# Altium project CW308T_K24F.PrjPcb
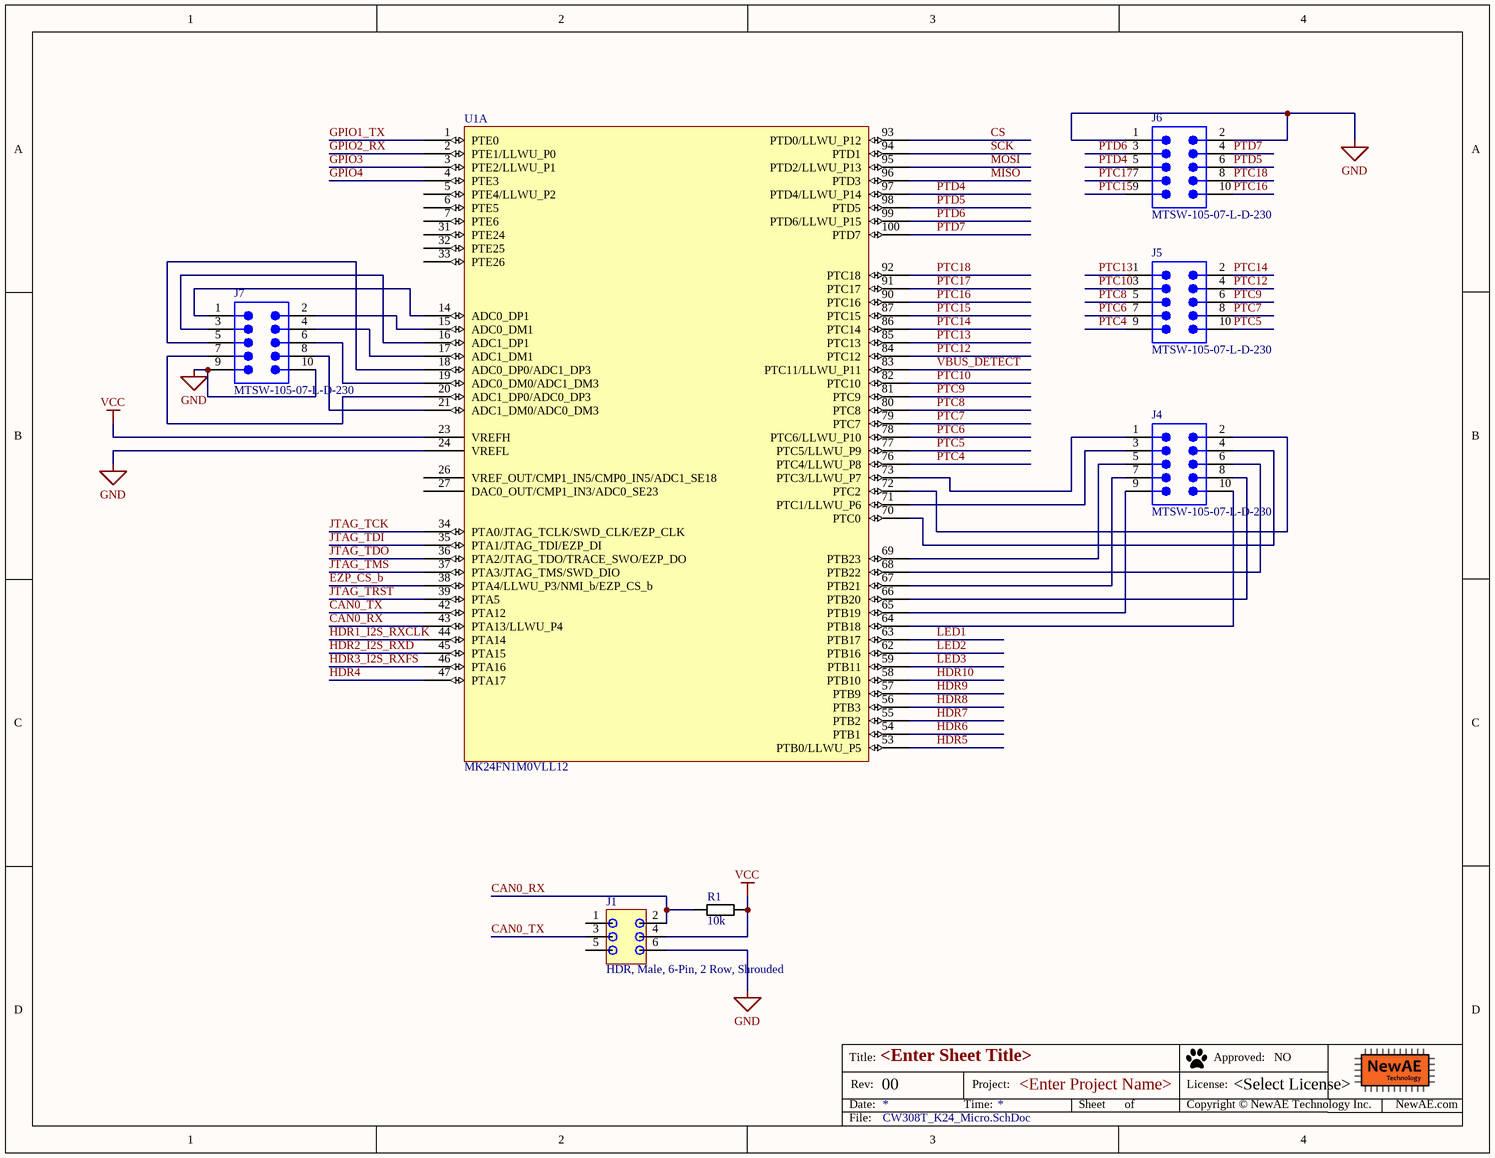
[diagram p0: CW308T_K24_Micro.SchDoc]
PrjLicense: <Select License>; PrjName: <Enter Project Name>; PrjRev: 00
3 sheets, 30 parts. Net scope: global (net labels, ports and power ports of the same name join across sheets).
Board files: CW308T_K24F_PANEL.PcbDoc, CW308T_K24F.PcbDoc
Sheets:
  CW308T_K24_Micro.SchDoc
  CW308T_K24_Misc.SchDoc
  CW308T_K24_UFO.SchDoc

## Sheet CW308T_K24_Micro.SchDoc: <Enter Sheet Title>
size Letter; Organization: NewAE Technology Inc.; Address1: 1083 Queen St., Suite 196; Address2: Halifax; Address3: NS; Address4: Canada B3H 0B2; SheetApproved: NO

### Parts
J1  HDR, Male, 6-Pin, 2 Row, Shrouded  [HDR_6PIN_2ROW_SHROUD]
J4  MTSW-105-07-L-D-230  [SMTC-MTSW-105-07-X-D-230]
J5  MTSW-105-07-L-D-230  [SMTC-MTSW-105-07-X-D-230]
J6  MTSW-105-07-L-D-230  [SMTC-MTSW-105-07-X-D-230]
J7  MTSW-105-07-L-D-230  [SMTC-MTSW-105-07-X-D-230]
R1  10k  [RESC1608X55N]
U1  MK24FN1M0VLL12  [SQFP50P1600X1600X170-100N]  (part A of 2)

### Nets
GND: J1.6 J6.1 J6.2 J7.9 J7.10 U1.24(VREFL)
VCC: J1.4 R1.2 U1.23(VREFH)
CAN0_RX: J1.2 R1.1 U1.43(PTA13/LLWU_P4)
CAN0_TX: J1.3 U1.42(PTA12)
CS: U1.93(PTD0/LLWU_P12)
EZP_CS_b: U1.38(PTA4/LLWU_P3/NMI_b/EZP_CS_b)
GPIO1_TX: U1.1(PTE0)
GPIO2_RX: U1.2(PTE1/LLWU_P0)
GPIO3: U1.3(PTE2/LLWU_P1)
GPIO4: U1.4(PTE3)
HDR1_I2S_RXCLK: U1.44(PTA14)
HDR2_I2S_RXD: U1.45(PTA15)
HDR3_I2S_RXFS: U1.46(PTA16)
HDR4: U1.47(PTA17)
HDR5: U1.53(PTB0/LLWU_P5)
HDR6: U1.54(PTB1)
HDR7: U1.55(PTB2)
HDR8: U1.56(PTB3)
HDR9: U1.57(PTB9)
HDR10: U1.58(PTB10)
JTAG_TCK: U1.34(PTA0/JTAG_TCLK/SWD_CLK/EZP_CLK)
JTAG_TDI: U1.35(PTA1/JTAG_TDI/EZP_DI)
JTAG_TDO: U1.36(PTA2/JTAG_TDO/TRACE_SWO/EZP_DO)
JTAG_TMS: U1.37(PTA3/JTAG_TMS/SWD_DIO)
JTAG_TRST: U1.39(PTA5)
LED1: U1.63(PTB17)
LED2: U1.62(PTB16)
LED3: U1.59(PTB11)
MISO: U1.96(PTD3)
MOSI: U1.95(PTD2/LLWU_P13)
PTC4: J5.9 U1.76(PTC4/LLWU_P8)
PTC5: J5.10 U1.77(PTC5/LLWU_P9)
PTC6: J5.7 U1.78(PTC6/LLWU_P10)
PTC7: J5.8 U1.79(PTC7)
PTC8: J5.5 U1.80(PTC8)
PTC9: J5.6 U1.81(PTC9)
PTC10: J5.3 U1.82(PTC10)
PTC12: J5.4 U1.84(PTC12)
PTC13: J5.1 U1.85(PTC13)
PTC14: J5.2 U1.86(PTC14)
PTC15: J6.9 U1.87(PTC15)
PTC16: J6.10 U1.90(PTC16)
PTC17: J6.7 U1.91(PTC17)
PTC18: J6.8 U1.92(PTC18)
PTD4: J6.5 U1.97(PTD4/LLWU_P14)
PTD5: J6.6 U1.98(PTD5)
PTD6: J6.3 U1.99(PTD6/LLWU_P15)
PTD7: J6.4 U1.100(PTD7)
SCK: U1.94(PTD1)
VBUS_DETECT: U1.83(PTC11/LLWU_P11)
NetJ4_1: J4.1 U1.73(PTC3/LLWU_P7)
NetJ4_2: J4.2 U1.72(PTC2)
NetJ4_3: J4.3 U1.71(PTC1/LLWU_P6)
NetJ4_4: J4.4 U1.70(PTC0)
NetJ4_5: J4.5 U1.69(PTB23)
NetJ4_6: J4.6 U1.68(PTB22)
NetJ4_7: J4.7 U1.67(PTB21)
NetJ4_8: J4.8 U1.66(PTB20)
NetJ4_9: J4.9 U1.65(PTB19)
NetJ4_10: J4.10 U1.64(PTB18)
NetJ7_1: J7.1 U1.14(ADC0_DP1)
NetJ7_2: J7.2 U1.15(ADC0_DM1)
NetJ7_3: J7.3 U1.16(ADC1_DP1)
NetJ7_4: J7.4 U1.17(ADC1_DM1)
NetJ7_5: J7.5 U1.18(ADC0_DP0/ADC1_DP3)
NetJ7_6: J7.6 U1.19(ADC0_DM0/ADC1_DM3)
NetJ7_7: J7.7 U1.20(ADC1_DP0/ADC0_DP3)
NetJ7_8: J7.8 U1.21(ADC1_DM0/ADC0_DM3)

Not connected (* = marked no-connect by the designer): J1 1 5; U1 5(PTE4/LLWU_P2) 6(PTE5) 7(PTE6) 26(VREF_OUT/CMP1_IN5/CMP0_IN5/ADC1_SE18) 27(DAC0_OUT/CMP1_IN3/ADC0_SE23) 31(PTE24) 32(PTE25) 33(PTE26)

### Notes on the sheet
- Title:
- Date:
- Rev:
- Time:
- Project:
- Sheet
- of
- License:
- Copyright © NewAE Technology Inc.
- Approved:
- NewAE.com
- File:

### Library data of the parts
J1 = HDR_6PIN_2ROW_SHROUD: Manufacture 1: FCI Connectors; Manufacture Part Number 1: 75869-131LF; Component Group: Connector; Part Number: HDR_6PIN_2ROW_SHROUD; Pin Count: 6; Supplier 1: Digi-Key; Supplier Part Number 1: 609-2845-ND; Mounting Technology: Through-hole; RoHS: Yes; Component Kind: Standard; Component Type: Standard
J4-J7 = CMP-1024-00115-1: Manufacturer: Samtec; Pitch: 2.54 mm; PackageReference: MTSW-105-07-X-D-230; ComponentLink3Description: Package Specification; PartNumber: MTSW-105-07-L-D-230; DatasheetVersion: F-214; RoHS: True; Orientation: Vertical; Temperature Range: -55 to 125 degC; PackageVersion: BI, 2/1987; ComponentLink2Description: Datasheet; ComponentLink3URL: http://www.samtec.com/documents/webfiles/cpdf/MTSW-XXX-XX-X-X-XXXX-XX-XXX-MKT1.pdf; ComponentLink1Description: Manufacturer URL; ComponentLink2URL: http://www.samtec.com/documents/webfiles/pdf/MTSW.PDF; Mounting Technology: Through-hole; ComponentLink1URL: http://www.samtec.com
R1 = RCHIP-10K-0603: 10k res, 0603, 1%, 1/10W; Manufacture 1: Yageo; Manufacture Part Number 1: RC0603FR-0710KL; Component Group: Resistor; Case-EIA: 0603; Case-Metric: 1608; Rated Power: 0.1W; Rated Voltage: 75VDC; Part Number: RCHIP-10K-0603; Footprint: 0603; Pin Count: 2; Supplier 1: Digi-Key; Supplier Part Number 1: 311-10.0KHRCT-ND; Value: 10k; Tolerance: 1%; Mounting Technology: SMT; Temperature Range: -55C to 155C; Component Kind: Standard; Component Type: Standard
U1 = MK24FN1M0VLL12: Manufacture 1: NXP; Component Group: Digital IC; PP Material Stack: 0; Part Number: MK24FN1M0VLL12; Component Kind: Standard; Component Type: Standard; PP Rotation: 0; Footprint: TQFP100; Manufacture Part Number 1: MK24FN1M0VLL12; Pin Count: 100

## Sheet CW308T_K24_Misc.SchDoc: <Enter Sheet Title>
size Letter; Organization: NewAE Technology Inc.; Address1: 1083 Queen St., Suite 196; Address2: Halifax; Address3: NS; Address4: Canada B3H 0B2; SheetApproved: NO
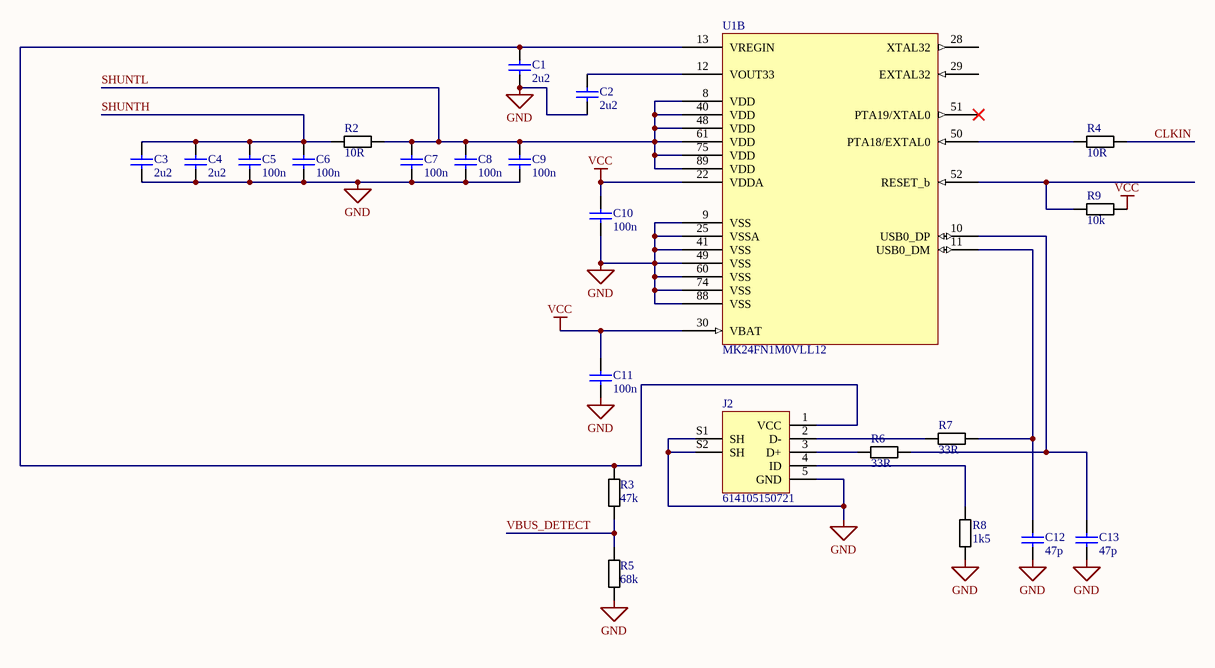
[diagram p1: CW308T_K24_Misc.SchDoc]

### Parts
C1  2u2  [CAPC0603_M]
C2  2u2  [CAPC0603_M]
C3  2u2  [CAPC0603_M]
C4  2u2  [CAPC0603_M]
C5  100n  [CAPC0603_M]
C6  100n  [CAPC0603_M]
C7  100n  [CAPC0603_M]
C8  100n  [CAPC0603_M]
C9  100n  [CAPC0603_M]
C10  100n  [CAPC0603_M]
C11  100n  [CAPC0603_M]
C12  47p  [CAPC0603_M]
C13  47p  [CAPC0603_M]
J2  614105150721  [614105150721]
R2  10R  [RESC1608X55N]
R3  47k  [RESC1608X55N]
R4  10R  [RESC1608X55N]
R5  68k  [RESC1608X55N]
R6  33R  [RESC1608X55N]
R7  33R  [RESC1608X55N]
R8  1k5  [RESC1608X55N]
R9  10k  [RESC1608X55N]
U1  MK24FN1M0VLL12  [SQFP50P1600X1600X170-100N]  (part B of 2)

### Nets
GND: C1.2 C2.2 C3.2 C4.2 C5.2 C6.2 C7.2 C8.2 C9.2 C10.2 C11.2 C12.2 C13.2 J2.5(GND) J2.S1(SH) J2.S2(SH) R5.2 R8.2 U1.9(VSS) U1.25(VSSA) U1.41(VSS) U1.49(VSS) U1.60(VSS) U1.74(VSS) U1.88(VSS)
VCC: C10.1 C11.1 R9.2 U1.22(VDDA) U1.30(VBAT)
CLKIN: R4.2
SHUNTH: C3.1 C4.1 C5.1 C6.1 R2.1
SHUNTL: C7.1 C8.1 C9.1 R2.2 U1.8(VDD) U1.40(VDD) U1.48(VDD) U1.61(VDD) U1.75(VDD) U1.89(VDD)
VBUS_DETECT: R3.2 R5.1
NetC1_1: C1.1 J2.1(VCC) R3.1 U1.13(VREGIN)
NetC2_1: C2.1 U1.12(VOUT33)
NetC12_1: C12.1 R7.2 U1.11(USB0_DM)
NetC13_1: C13.1 R6.1 U1.10(USB0_DP)
NetJ2_2: J2.2(D-) R7.1
NetJ2_3: J2.3(D+) R6.2
NetJ2_4: J2.4(ID) R8.1
NetR4_1: R4.1 U1.50(PTA18/EXTAL0)
NetR9_1: R9.1 U1.52(RESET_b)

Not connected (* = marked no-connect by the designer): U1 28(XTAL32) 29(EXTAL32) 51(PTA19/XTAL0)*

### Notes on the sheet
- Title:
- Date:
- Rev:
- Time:
- Project:
- Sheet
- of
- License:
- Copyright © NewAE Technology Inc.
- Approved:
- NewAE.com
- File:

### Library data of the parts
C1-C4 = CCHIP-2u2-0603: 2u2, 0603; Manufacture 1: Samsung; Manufacture Part Number 1: CL10B225KP8NNNC; Component Group: Capacitor; Case-EIA: 0603; Case-Metric: 1608; Rated Voltage: 10VDC; Part Number: CCHIP-2u2-0603; Footprint: 0603; Pin Count: 2; Supplier 1: Digi-Key; Supplier Part Number 1: 1276-1134-2-ND; Value: 2u2; Mounting Technology: SMT; Component Kind: Standard; Component Type: Standard
C5-C11 = CCHIP-100n-0603: 100n, 0603; Manufacture 1: Kemet; Manufacture Part Number 1: C0603C104K5RACTU; Component Group: Capacitor; Case-EIA: 0603; Case-Metric: 1608; Rated Voltage: 50VDC; Part Number: CCHIP-100n-0603; Footprint: 0603; Pin Count: 2; Supplier 1: Digi-Key; Supplier Part Number 1: 399-5089-2-ND; Value: 100n; Mounting Technology: SMT; Component Kind: Standard; Component Type: Standard
C12 C13 = CCHIP-47p-0603: 47p, 0603; Component Group: Capacitor; Case-EIA: 0603; Case-Metric: 1608; Part Number: CCHIP-47p-0603; Footprint: 0603; Pin Count: 2; Value: 47p; Mounting Technology: SMT; Component Kind: Standard; Component Type: Standard
J2 = 614105150721: USB, 5-pin, Upright; Manufacture 1: Wurth Electronics; Component Group: Connector; PP Material Stack: 0; Part Number: 614105150721; Manufacture Part Number 1: 614105150721; Pin Count: 7; Supplier 1: Digi-Key; Supplier Part Number 1: 732-5958-1-ND; Mounting Technology: Through-hole; RoHS: Yes; Component Kind: Standard; Component Type: Standard; PP Rotation: 0
R2 R4 = RCHIP-10R-0603: 10R res, 0603, 1%, 1/10W; Manufacture 1: Yageo; Manufacture Part Number 1: RC0603FR-0710RL; Component Group: Resistor; Case-EIA: 0603; Case-Metric: 1608; Rated Power: 0.1W; Rated Voltage: 75VDC; Part Number: RCHIP-10R-0603; Footprint: 0603; Pin Count: 2; Supplier 1: Digi-Key; Supplier Part Number 1: 311-10.0HRCT-ND; Value: 10R; Tolerance: 1%; Mounting Technology: SMT; Temperature Range: -55C to 155C; Component Kind: Standard; Component Type: Standard
R3 = RCHIP-47K-0603: 47k res, 0603, 1%, 1/10W; Manufacture 1: Yageo; Manufacture Part Number 1: RC0603FR-0747KL; Component Group: Resistor; Case-EIA: 0603; Case-Metric: 1608; Rated Power: 0.1W; Rated Voltage: 75VDC; Part Number: RCHIP-47K-0603; Footprint: 0603; Pin Count: 2; Supplier 1: Digi-Key; Supplier Part Number 1: 311-47.0KHRCT-ND; Value: 47k; Tolerance: 1%; Mounting Technology: SMT; Temperature Range: -55C to 155C; Component Kind: Standard; Component Type: Standard
R5 = RCHIP-68K-0603: 68k res, 0603, 1%, 1/10W; Manufacture 1: Yageo; Manufacture Part Number 1: RC0603FR-0768KL; Component Group: Resistor; Case-EIA: 0603; Case-Metric: 1608; Rated Power: 0.1W; Rated Voltage: 75VDC; Part Number: RCHIP-68K-0603; Footprint: 0603; Pin Count: 2; Supplier 1: Digi-Key; Supplier Part Number 1: 311-68.0KHRCT-ND; Value: 68k; Tolerance: 1%; Mounting Technology: SMT; Temperature Range: -55C to 155C; Component Kind: Standard; Component Type: Standard
R6 R7 = RCHIP-33R-0603: 33R res, 0603, 1%, 1/10W; Manufacture 1: Yageo; Manufacture Part Number 1: RC0603FR-0733RL; Component Group: Resistor; Case-EIA: 0603; Case-Metric: 1608; Rated Power: 0.1W; Rated Voltage: 75VDC; Part Number: RCHIP-33R-0603; Footprint: 0603; Pin Count: 2; Supplier 1: Digi-Key; Supplier Part Number 1: 311-33.0HRCT-ND; Value: 33R; Tolerance: 1%; Mounting Technology: SMT; Temperature Range: -55C to 155C; Component Kind: Standard; Component Type: Standard
R8 = RCHIP-1K5-0603: 1k5 res, 0603, 1%, 1/10W; Manufacture 1: Yageo; Manufacture Part Number 1: RC0603FR-071K5L; Component Group: Resistor; Case-EIA: 0603; Case-Metric: 1608; Rated Power: 0.1W; Rated Voltage: 75VDC; Part Number: RCHIP-1K5-0603; Footprint: 0603; Pin Count: 2; Supplier 1: Digi-Key; Supplier Part Number 1: 311-1.50KHRCT-ND; Value: 1k5; Tolerance: 1%; Mounting Technology: SMT; Temperature Range: -55C to 155C; Component Kind: Standard; Component Type: Standard
R9 = RCHIP-10K-0603: as R1 on sheet CW308T_K24_Micro; Part Number: RCHIP-10K-0603; Footprint: 0603; Pin Count: 2; Supplier 1: Digi-Key; Supplier Part Number 1: 311-10.0KHRCT-ND; Value: 10k; Tolerance: 1%; Mounting Technology: SMT; Temperature Range: -55C to 155C; Component Kind: Standard; Component Type: Standard
U1 = MK24FN1M0VLL12: as U1 on sheet CW308T_K24_Micro; Part Number: MK24FN1M0VLL12; Component Kind: Standard; Component Type: Standard; PP Rotation: 0; Footprint: TQFP100; Manufacture Part Number 1: MK24FN1M0VLL12; Pin Count: 100

## Sheet CW308T_K24_UFO.SchDoc: <Enter Sheet Title>
size Letter; Organization: NewAE Technology Inc.; Address1: 1083 Queen St., Suite 196; Address2: Halifax; Address3: NS; Address4: Canada B3H 0B2; SheetApproved: NO
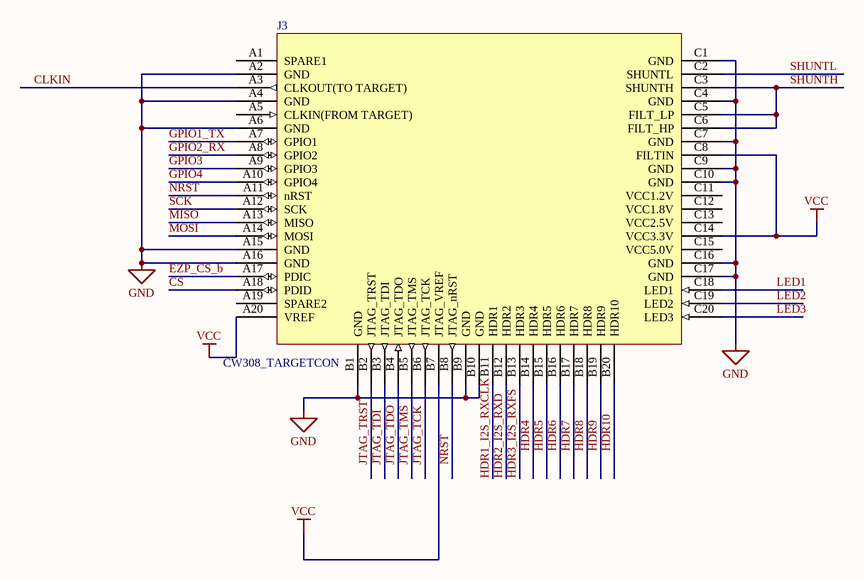
[diagram p2: CW308T_K24_UFO.SchDoc]

### Parts
J3  CW308_TARGETCON  [CW308_TBOARD_CONN]

### Nets
GND: J3.A2(GND) J3.A4(GND) J3.A6(GND) J3.A15(GND) J3.A16(GND) J3.B1(GND) J3.B9(GND) J3.B10(GND) J3.C1(GND) J3.C4(GND) J3.C7(GND) J3.C9(GND) J3.C10(GND) J3.C16(GND) J3.C17(GND)
VCC: J3.A20(VREF) J3.B7(JTAG_VREF) J3.C8(FILTIN) J3.C14(VCC3.3V)
CLKIN: J3.A3(CLKOUT(TO_TARGET))
CS: J3.A18(PDID)
EZP_CS_b: J3.A17(PDIC)
GPIO1_TX: J3.A7(GPIO1)
GPIO2_RX: J3.A8(GPIO2)
GPIO3: J3.A9(GPIO3)
GPIO4: J3.A10(GPIO4)
HDR1_I2S_RXCLK: J3.B11(HDR1)
HDR2_I2S_RXD: J3.B12(HDR2)
HDR3_I2S_RXFS: J3.B13(HDR3)
HDR4: J3.B14(HDR4)
HDR5: J3.B15(HDR5)
HDR6: J3.B16(HDR6)
HDR7: J3.B17(HDR7)
HDR8: J3.B18(HDR8)
HDR9: J3.B19(HDR9)
HDR10: J3.B20(HDR10)
JTAG_TCK: J3.B6(JTAG_TCK)
JTAG_TDI: J3.B3(JTAG_TDI)
JTAG_TDO: J3.B4(JTAG_TDO)
JTAG_TMS: J3.B5(JTAG_TMS)
JTAG_TRST: J3.B2(JTAG_TRST)
LED1: J3.C18(LED1)
LED2: J3.C19(LED2)
LED3: J3.C20(LED3)
MISO: J3.A13(MISO)
MOSI: J3.A14(MOSI)
NRST: J3.A11(nRST) J3.B8(JTAG_nRST)
SCK: J3.A12(SCK)
SHUNTH: J3.C3(SHUNTH) J3.C5(FILT_LP) J3.C6(FILT_HP)
SHUNTL: J3.C2(SHUNTL)

Not connected (* = marked no-connect by the designer): J3 A1(SPARE1) A5(CLKIN(FROM_TARGET)) A19(SPARE2) C11(VCC1.2V) C12(VCC1.8V) C13(VCC2.5V) C15(VCC5.0V)

### Notes on the sheet
- Title:
- Date:
- Rev:
- Time:
- Project:
- Sheet
- of
- License:
- Copyright © NewAE Technology Inc.
- Approved:
- NewAE.com
- File:

### Library data of the parts
J3 = CW308_TBOARD: CW308 "Standard" Target Board Connector; Component Group: Mechanical; Pitch: 2.54mm; Part Number: CW308_TBOARD; Pin Count: 60; Mounting Technology: Through-hole; Component Kind: Standard; Component Type: Standard

## Nets that join several sheets
GND: CW308T_K24_Micro (6 pins), CW308T_K24_Misc (25 pins), CW308T_K24_UFO (15 pins)
VCC: CW308T_K24_Micro (J1.4 R1.2 U1.23), CW308T_K24_Misc (5 pins), CW308T_K24_UFO (J3.A20 J3.B7 J3.C8 J3.C14)
CLKIN: CW308T_K24_Misc (R4.2), CW308T_K24_UFO (J3.A3)
CS: CW308T_K24_Micro (U1.93), CW308T_K24_UFO (J3.A18)
EZP_CS_b: CW308T_K24_Micro (U1.38), CW308T_K24_UFO (J3.A17)
GPIO1_TX: CW308T_K24_Micro (U1.1), CW308T_K24_UFO (J3.A7)
GPIO2_RX: CW308T_K24_Micro (U1.2), CW308T_K24_UFO (J3.A8)
GPIO3: CW308T_K24_Micro (U1.3), CW308T_K24_UFO (J3.A9)
GPIO4: CW308T_K24_Micro (U1.4), CW308T_K24_UFO (J3.A10)
HDR1_I2S_RXCLK: CW308T_K24_Micro (U1.44), CW308T_K24_UFO (J3.B11)
HDR2_I2S_RXD: CW308T_K24_Micro (U1.45), CW308T_K24_UFO (J3.B12)
HDR3_I2S_RXFS: CW308T_K24_Micro (U1.46), CW308T_K24_UFO (J3.B13)
HDR4: CW308T_K24_Micro (U1.47), CW308T_K24_UFO (J3.B14)
HDR5: CW308T_K24_Micro (U1.53), CW308T_K24_UFO (J3.B15)
HDR6: CW308T_K24_Micro (U1.54), CW308T_K24_UFO (J3.B16)
HDR7: CW308T_K24_Micro (U1.55), CW308T_K24_UFO (J3.B17)
HDR8: CW308T_K24_Micro (U1.56), CW308T_K24_UFO (J3.B18)
HDR9: CW308T_K24_Micro (U1.57), CW308T_K24_UFO (J3.B19)
HDR10: CW308T_K24_Micro (U1.58), CW308T_K24_UFO (J3.B20)
JTAG_TCK: CW308T_K24_Micro (U1.34), CW308T_K24_UFO (J3.B6)
JTAG_TDI: CW308T_K24_Micro (U1.35), CW308T_K24_UFO (J3.B3)
JTAG_TDO: CW308T_K24_Micro (U1.36), CW308T_K24_UFO (J3.B4)
JTAG_TMS: CW308T_K24_Micro (U1.37), CW308T_K24_UFO (J3.B5)
JTAG_TRST: CW308T_K24_Micro (U1.39), CW308T_K24_UFO (J3.B2)
LED1: CW308T_K24_Micro (U1.63), CW308T_K24_UFO (J3.C18)
LED2: CW308T_K24_Micro (U1.62), CW308T_K24_UFO (J3.C19)
LED3: CW308T_K24_Micro (U1.59), CW308T_K24_UFO (J3.C20)
MISO: CW308T_K24_Micro (U1.96), CW308T_K24_UFO (J3.A13)
MOSI: CW308T_K24_Micro (U1.95), CW308T_K24_UFO (J3.A14)
SCK: CW308T_K24_Micro (U1.94), CW308T_K24_UFO (J3.A12)
SHUNTH: CW308T_K24_Misc (5 pins), CW308T_K24_UFO (J3.C3 J3.C5 J3.C6)
SHUNTL: CW308T_K24_Misc (10 pins), CW308T_K24_UFO (J3.C2)
VBUS_DETECT: CW308T_K24_Micro (U1.83), CW308T_K24_Misc (R3.2 R5.1)